# Altium schematic sheet Sheet1.SchDoc
size A4
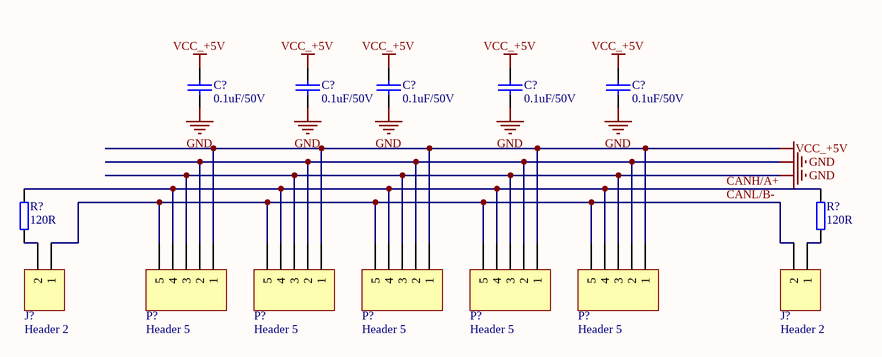
[diagram p0: Sheet1.SchDoc]

## Parts
(Parts that share a designator on the sheet are numbered #1, #2 ... from top to bottom, then left to right.)
C?#1  0.1uF/50V  [0603C]
C?#2  0.1uF/50V  [0603C]
C?#3  0.1uF/50V  [0603C]
C?#4  0.1uF/50V  [0603C]
C?#5  0.1uF/50V  [0603C]
J?#1  Header 2  [HDR1*2]
J?#2  Header 2  [HDR1*2]
P?#1  Header 5  [XH2.54-5P]
P?#2  Header 5  [XH2.54-5P]
P?#3  Header 5  [XH2.54-5P]
P?#4  Header 5  [XH2.54-5P]
P?#5  Header 5  [XH2.54-5P]
R?#1  120R  [0603R]
R?#2  120R  [0603R]

## Nets
GND: C?#1.1 C?#2.1 C?#3.1 C?#4.1 C?#5.1 P?#1.2 P?#1.3 P?#2.2 P?#2.3 P?#3.2 P?#3.3 P?#4.2 P?#4.3 P?#5.2 P?#5.3
VCC_+5V: C?#1.2 C?#2.2 C?#3.2 C?#4.2 C?#5.2 P?#1.1 P?#2.1 P?#3.1 P?#4.1 P?#5.1
CANH/A+: P?#1.4 P?#2.4 P?#3.4 P?#4.4 P?#5.4 R?#1.2 R?#2.2
CANL/B-: J?#1.1 J?#2.2 P?#1.5 P?#2.5 P?#3.5 P?#4.5 P?#5.5
NetJ?#1_2: J?#1.2 R?#1.1
NetJ?#2_1: J?#2.1 R?#2.1

## Library data of the parts
C?#1-C?#5 = CAP: Capacitor
J?#1 J?#2 = Header 2: Header, 2-Pin; LatestRevisionDate: 17-Jul-2002; LatestRevisionNote: Re-released for DXP Platform.; Publisher: Altium Limited
P?#1-P?#5 = Header 5: Header, 5-Pin; LatestRevisionDate: 17-Jul-2002; LatestRevisionNote: Re-released for DXP Platform.; Publisher: Altium Limited
R?#1 R?#2 = RES2A